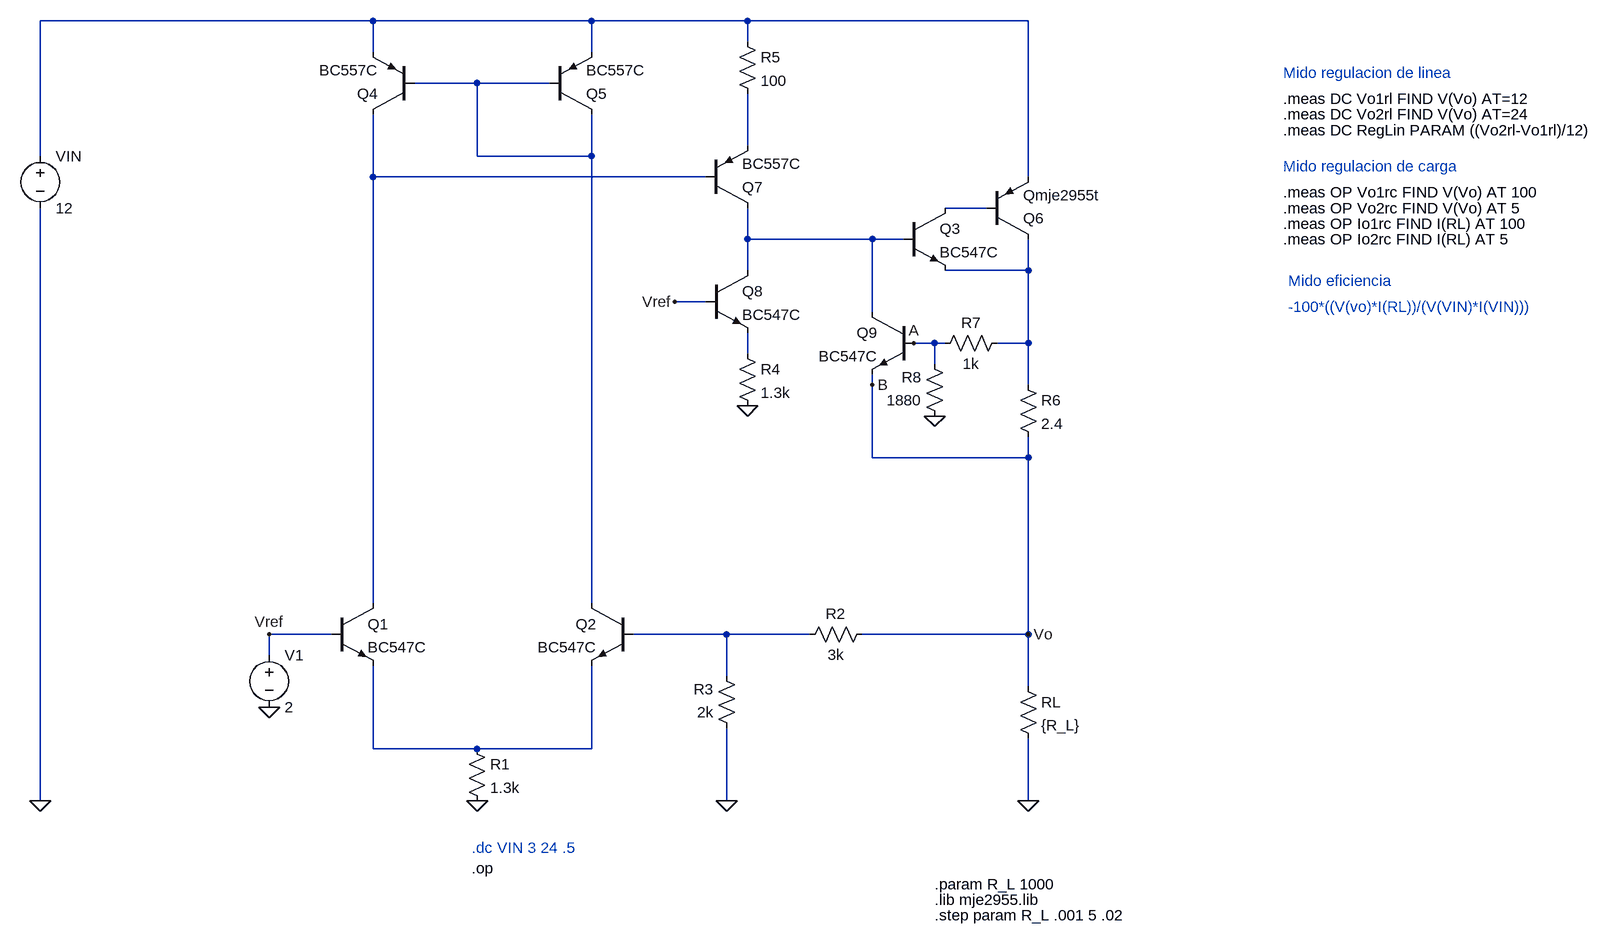
[diagram p0: schematic primer_check_6.asc]
primer_check_6.asc, the LTspice schematic file:
Version 4.1
SHEET 1 880 1040
WIRE -1888 -352 -2400 -352
WIRE -1552 -352 -1888 -352
WIRE -1312 -352 -1552 -352
WIRE -880 -352 -1312 -352
WIRE -1312 -320 -1312 -352
WIRE -1888 -304 -1888 -352
WIRE -1552 -304 -1552 -352
WIRE -1728 -256 -1824 -256
WIRE -1616 -256 -1728 -256
WIRE -1312 -160 -1312 -240
WIRE -2400 -144 -2400 -352
WIRE -1728 -144 -1728 -256
WIRE -1552 -144 -1552 -208
WIRE -1552 -144 -1728 -144
WIRE -1888 -112 -1888 -208
WIRE -1376 -112 -1888 -112
WIRE -880 -112 -880 -352
WIRE -944 -64 -1008 -64
WIRE -1312 -16 -1312 -64
WIRE -1120 -16 -1312 -16
WIRE -1072 -16 -1120 -16
WIRE -1312 32 -1312 -16
WIRE -880 32 -880 -16
WIRE -880 32 -1008 32
WIRE -1376 80 -1424 80
WIRE -1120 96 -1120 -16
WIRE -1024 144 -1056 144
WIRE -1008 144 -1024 144
WIRE -880 144 -880 32
WIRE -880 144 -928 144
WIRE -1312 160 -1312 128
WIRE -1024 176 -1024 144
WIRE -1120 208 -1120 192
WIRE -880 208 -880 144
WIRE -1120 320 -1120 208
WIRE -880 320 -880 288
WIRE -880 320 -1120 320
WIRE -1888 544 -1888 -112
WIRE -1552 544 -1552 -144
WIRE -1952 592 -2048 592
WIRE -1344 592 -1488 592
WIRE -1216 592 -1344 592
WIRE -880 592 -880 320
WIRE -880 592 -1136 592
WIRE -2048 624 -2048 592
WIRE -1344 656 -1344 592
WIRE -880 672 -880 592
WIRE -1888 768 -1888 640
WIRE -1728 768 -1888 768
WIRE -1552 768 -1552 640
WIRE -1552 768 -1728 768
WIRE -2400 848 -2400 -64
WIRE -1344 848 -1344 736
WIRE -880 848 -880 752
FLAG -2048 704 0
FLAG -1728 848 0
FLAG -880 848 0
FLAG -2400 848 0
FLAG -1344 848 0
FLAG -880 592 Vo
FLAG -1312 240 0
FLAG -2048 592 Vref
FLAG -1424 80 Vref
FLAG -1024 256 0
FLAG -1056 144 A
FLAG -1120 208 B
SYMBOL npn -1952 544 R0
SYMATTR InstName Q1
SYMATTR Value BC547C
SYMBOL npn -1488 544 M0
SYMATTR InstName Q2
SYMATTR Value BC547C
SYMBOL npn -1072 -64 R0
SYMATTR InstName Q3
SYMATTR Value BC547C
SYMBOL pnp -1824 -208 R180
SYMATTR InstName Q4
SYMATTR Value BC557C
SYMBOL pnp -1616 -208 M180
SYMATTR InstName Q5
SYMATTR Value BC557C
SYMBOL res -1744 752 R0
SYMATTR InstName R1
SYMATTR Value 1.3k
SYMBOL voltage -2048 608 R0
WINDOW 123 0 0 Left 0
WINDOW 39 0 0 Left 0
SYMATTR InstName V1
SYMATTR Value 2
SYMBOL voltage -2400 -160 R0
WINDOW 123 0 0 Left 0
WINDOW 39 0 0 Left 0
SYMATTR InstName VIN
SYMATTR Value 12
SYMBOL pnp -944 -16 M180
SYMATTR InstName Q6
SYMATTR Value Qmje2955t
SYMBOL res -896 656 R0
SYMATTR InstName RL
SYMATTR Value {R_L}
SYMBOL res -1120 576 R90
WINDOW 0 0 56 VBottom 2
WINDOW 3 32 56 VTop 2
SYMATTR InstName R2
SYMATTR Value 3k
SYMBOL res -1328 752 R180
WINDOW 0 36 76 Left 2
WINDOW 3 36 40 Left 2
SYMATTR InstName R3
SYMATTR Value 2k
SYMBOL pnp -1376 -64 M180
SYMATTR InstName Q7
SYMATTR Value BC557C
SYMBOL npn -1376 32 R0
SYMATTR InstName Q8
SYMATTR Value BC547C
SYMBOL res -1328 144 R0
SYMATTR InstName R4
SYMATTR Value 1.3k
SYMBOL res -1328 -336 R0
SYMATTR InstName R5
SYMATTR Value 100
SYMBOL res -896 192 R0
SYMATTR InstName R6
SYMATTR Value 2.4
SYMBOL npn -1056 96 M0
SYMATTR InstName Q9
SYMATTR Value BC547C
SYMBOL res -912 128 R90
WINDOW 0 0 56 VBottom 2
WINDOW 3 32 56 VTop 2
SYMATTR InstName R7
SYMATTR Value 1k
SYMBOL res -1008 272 R180
WINDOW 0 36 76 Left 2
WINDOW 3 36 40 Left 2
SYMATTR InstName R8
SYMATTR Value 1880
TEXT -1024 976 Left 2 !.param R_L 1000
TEXT -1024 1000 Left 2 !.lib mje2955.lib
TEXT -1736 920 Left 2 ;.dc VIN 3 24 .5
TEXT -1024 1024 Left 2 !.step param R_L .001 5 .02
TEXT -1736 952 Left 2 !.op
TEXT -488 -272 Left 2 ;Mido regulacion de linea
TEXT -488 -232 Left 2 !.meas DC Vo1rl FIND V(Vo) AT=12
TEXT -488 -208 Left 2 !.meas DC Vo2rl FIND V(Vo) AT=24
TEXT -488 -184 Left 2 !.meas DC RegLin PARAM ((Vo2rl-Vo1rl)/12)
TEXT -488 -128 Left 2 ;Mido regulacion de carga
TEXT -488 -88 Left 2 !.meas OP Vo1rc FIND V(Vo) AT 100
TEXT -488 -64 Left 2 !.meas OP Vo2rc FIND V(Vo) AT 5
TEXT -488 -40 Left 2 !.meas OP Io1rc FIND I(RL) AT 100
TEXT -488 -16 Left 2 !.meas OP Io2rc FIND I(RL) AT 5
TEXT -480 48 Left 2 ;Mido eficiencia
TEXT -480 88 Left 2 ;-100*((V(vo)*I(RL))/(V(VIN)*I(VIN)))

The netlist it stands for:
* primer_check_6.asc
Q1 N004 Vref N010 0 BC547C
Q2 N002 N009 N010 0 BC547C
Q3 N005 N006 N007 0 BC547C
Q4 N004 N002 N001 0 BC557C
Q5 N002 N002 N001 0 BC557C
R1 N010 0 1.3k
V1 Vref 0 2
VIN N001 0 12
Q6 N007 N005 N001 0 Qmje2955t
RL B 0 {R_L}
R2 B N009 3k
R3 0 N009 2k
Q7 N006 N004 N003 0 BC557C
Q8 N006 Vref N008 0 BC547C
R4 N008 0 1.3k
R5 N001 N003 100
R6 N007 B 2.4
Q9 N006 A B 0 BC547C
R7 N007 A 1k
R8 0 A 1880
.model NPN NPN
.model PNP PNP
.lib standard.bjt
.param R_L 1000
.lib mje2955.lib
* .dc VIN 3 24 .5
.step param R_L .001 5 .02
.op
* Mido regulacion de linea
.meas DC Vo1rl FIND V(Vo) AT=12
.meas DC Vo2rl FIND V(Vo) AT=24
.meas DC RegLin PARAM ((Vo2rl-Vo1rl)/12)
* Mido regulacion de carga
.meas OP Vo1rc FIND V(Vo) AT 100
.meas OP Vo2rc FIND V(Vo) AT 5
.meas OP Io1rc FIND I(RL) AT 100
.meas OP Io2rc FIND I(RL) AT 5
* Mido eficiencia
* -100*((V(vo)*I(RL))/(V(VIN)*I(VIN)))
.backanno
.end